# EAGLE design FCCH_RFID_ESTOP (EAGLE 9.6.2)
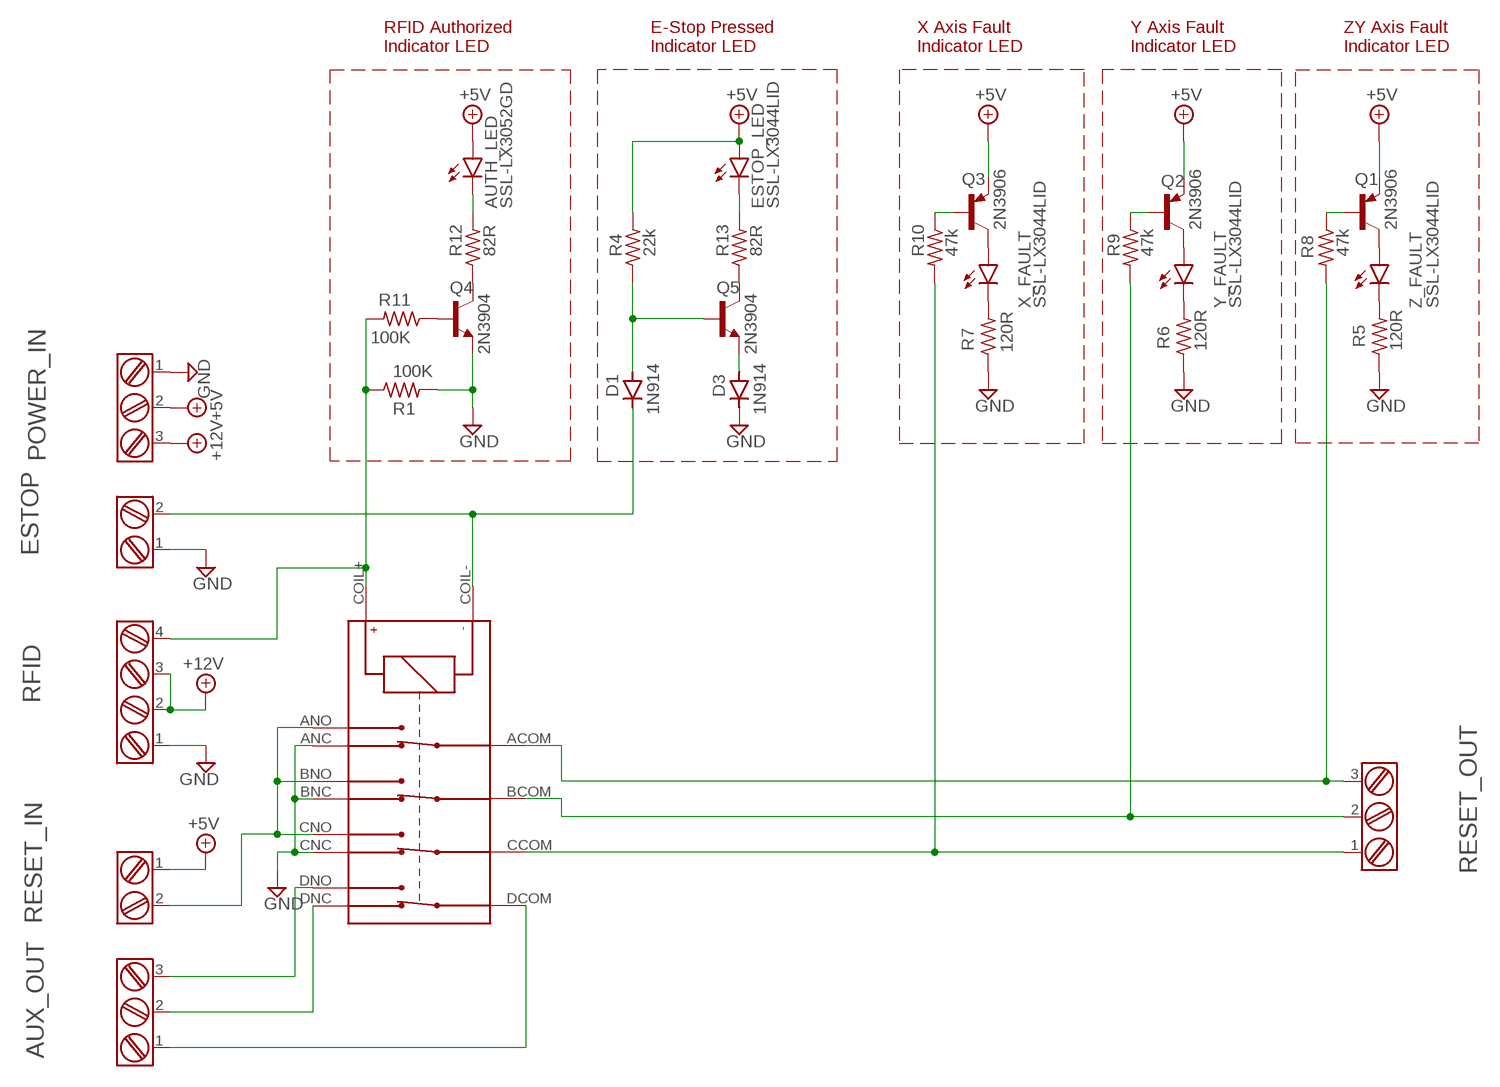
[diagram p0: schematic, sheet 1]

## Parts
AUTH_LED  SSL-LX3052GD  LED3MM  [LED3MM]
AUX_OUT  EURO-CON-3_2.54P  [CONN3-2.54P]
D1  1N914  DIODE-D-5  [D-5]
D3  1N914  DIODE-D-5  [D-5]
ESTOP  EURO-CON-2_2.54P  [CONN2_2.54P]
ESTOP_LED  SSL-LX3044LID  LED3MM  [LED3MM]
POWER_IN  EURO-CON-3_2.54P  [CONN3-2.54P]
Q1  2N3906  [TO92]
Q2  2N3906  [TO92]
Q3  2N3906  [TO92]
Q4  2N3904  [TO92]
Q5  2N3904  [TO92]
R1  100K  R-US_0204/7  [0204/7]
R4  22k  R-US_0204/7  [0204/7]
R5  120R  R-US_0204/7  [0204/7]
R6  120R  R-US_0204/7  [0204/7]
R7  120R  R-US_0204/7  [0204/7]
R8  47k  R-US_0204/7  [0204/7]
R9  47k  R-US_0204/7  [0204/7]
R10  47k  R-US_0204/7  [0204/7]
R11  100K  R-US_0204/7  [0204/7]
R12  82R  R-US_0204/7  [0204/7]
R13  82R  R-US_0204/7  [0204/7]
RESET_IN  EURO-CON-2_2.54P  [CONN2_2.54P]
RESET_OUT  EURO-CON-3_2.54P  [CONN3-2.54P]
RFID  EURO-CON-4_2.54P  [CONN4-2.54P]
U$1  NC4D-JP-DC5V  [NC4D-JP]
X_FAULT  SSL-LX3044LID  LED3MM  [LED3MM]
Y_FAULT  SSL-LX3044LID  LED3MM  [LED3MM]
Z_FAULT  SSL-LX3044LID  LED3MM  [LED3MM]

## Nets
+5V [Power]: AUTH_LED.A ESTOP_LED.A POWER_IN.2 Q1.3(E) Q2.3(E) Q3.3(E) R4.2 RESET_IN.1
+12V [Power]: POWER_IN.3 RFID.2 RFID.3
AUX_RELAY_COM: AUX_OUT.1 U$1.DCOM
AUX_RELAY_NC: AUX_OUT.2 U$1.DNC
AUX_RELAY_NO: AUX_OUT.3 U$1.DNO
ESTOP: D1.C ESTOP.2 U$1.COIL-
GND [Power]: D3.C ESTOP.1 POWER_IN.1 Q4.3(E) R1.2 R5.1 R6.1 R7.1 RFID.1 U$1.ANC U$1.BNC U$1.CNC
N$1: R7.2 X_FAULT.K(C)
N$2: RESET_IN.2 U$1.ANO U$1.BNO U$1.CNO
N$3: Q4.1(C) R12.1
N$4: Q4.2(B) R11.1
N$5: D1.A Q5.2(B) R4.1
N$6: Q5.1(C) R13.1
N$7: D3.A Q5.3(E)
N$8: Q3.1(C) X_FAULT.A
N$9: R6.2 Y_FAULT.K(C)
N$10: Q2.1(C) Y_FAULT.A
N$11: R5.2 Z_FAULT.K(C)
N$12: Q1.1(C) Z_FAULT.A
N$15: ESTOP_LED.K(C) R13.2
N$16: Q3.2(B) R10.1
N$17: AUTH_LED.K(C) R12.2
N$20: Q2.2(B) R9.1
N$24: Q1.2(B) R8.1
RFID_ENABLE: R1.1 R11.2 RFID.4 U$1.COIL+
X_ERR/RES: R10.2 RESET_OUT.1 U$1.CCOM
Y_ERR/RES: R9.2 RESET_OUT.2 U$1.BCOM
Z_ERR/RES: R8.2 RESET_OUT.3 U$1.ACOM

## Notes on the sheet
- RFID Authorized
  Indicator LED
- E-Stop Pressed
  Indicator LED
- X Axis Fault
  Indicator LED
- Y Axis Fault
  Indicator LED
- ZY Axis Fault
  Indicator LED

## Library data of the parts
AUTH_LED ESTOP_LED X_FAULT Y_FAULT Z_FAULT = led:LED: LED OSRAM: - CHIPLED LG R971, LG N971, LY N971, LG Q971, LY Q971, LO R971, LY R971 LH N974, LH R974 LS Q976, LO Q976, LY Q976 LO Q996 - Hyper CHIPLED LW Q18S LB Q993, LB Q99A, LB R99A - SideLED LS A670, LO A670, LY A670, LG A670, LP A670 LB A673, LV A673, LT A673, LW A673 LH A674 LY A675 LS A676, LA A676, LO A676, LY A676, LW A676 LS A679, LY A679, LG A679 - Hyper Micro SIDELED® LS Y876, LA Y876, LO Y876, LY Y876 LT Y87S - SmartLED LW L88C, LW L88S LB L89C, LB L89S, LG L890 LS L89K, LO L89K, LY L89K LS L896, LA L896, LO L896, LY L896 - TOPLED LS T670, LO T670, LY T670, LG T670, LP T670 LSG T670, LSP T670, LSY T670, LOP T670, LYG T670 LG T671, LOG T671, LSG T671 LB T673, LV T673, LT T673, LW T673 LH T674 LS T676, LA T676, LO T676, LY T676, LB T676, LH T676, LSB T676, LW T676 LB T67C, LV T67C, LT T67C, LS T67K, LO T67K, LY T67K, LW E67C LS E67B, LA E67B, LO E67B, LY E67B, LB E67C, LV E67C, LT E67C LW T67C LS T679, LY T679, LG T679 LS T770, LO T770, LY T770, LG T770, LP T770 LB T773, LV T773, LT T773, LW T773 LH T774 LS E675, LA E675, LY E675, LS T675 LS T776, LA T776, LO T776, LY T776, LB T776 LHGB T686 LT T68C, LB T68C - Hyper Mini TOPLED® LB M676 - Mini TOPLED Santana® LG M470 LS M47K, LO M47K, LY M47K Source: http://www.osram.convergy.de LUXEON: - LUMILED® LXK2-PW12-R00, LXK2-PW12-S00, LXK2-PW14-U00, LXK2-PW14-V00 LXK2-PM12-R00, LXK2-PM12-S00, LXK2-PM14-U00 LXK2-PE12-Q00, LXK2-PE12-R00, LXK2-PE12-S00, LXK2-PE14-T00, LXK2-PE14-U00 LXK2-PB12-K00, LXK2-PB12-L00, LXK2-PB12-M00, LXK2-PB14-N00, LXK2-PB14-P00, LXK2-PB14-Q00 LXK2-PR12-L00, LXK2-PR12-M00, LXK2-PR14-Q00, LXK2-PR14-R00 LXK2-PD12-Q00, LXK2-PD12-R00, LXK2-PD12-S00 LXK2-PH12-R00, LXK2-PH12-S00 LXK2-PL12-P00, LXK2-PL12-Q00, LXK2-PL12-R00 Source: www.luxeon.com KINGBRIGHT: KA-3528ASYC Source: www.kingbright.com
AUX_OUT POWER_IN RESET_OUT = fcch_eagle_parts_metal_mill:EURO-CON-3: Terminal block PCB Mound Side Wire Entry Stacking; CENTROID_NOT_SPECIFIED: No; CONTACT_MATERIAL: Brass; CONTACT_PLATING: Tin; DATASHEET: http://www.te.com/commerce/DocumentDelivery/DDEController?Action=srchrtrv&DocNm=282834&DocType=Customer+Drawing&DocLang=English; DIGIKEY_DESCRIPTION: CONN 3 Position Wire to Board Terminal Block Horizontal with Board 0.100" (2.54mm) Through Hole; DIGIKEY_PART_NUMBER: A98334-ND; ELV_COMPLIANT: Compliant; FLAMMABILITY_RATING: UL 94 V-0; HOUSING_COLOR: Green; HOUSING_MATERIAL: Nylon 6/6; IMPORTED_FROM: octopart; IS_FEMALE: yes; LEAD_FREE: yes; MF: TE; MOUNTING_TYPE: through hole; MOUSER_PART_NUMBER: 571-2828343; MPN: 282834-3; NUMBER_OF_CONTACTS: 3; NUMBER_OF_POSITIONS: 3; NUMBER_OF_ROWS: 1; NUM_PINS: 3; OCTOPART_PART_NUMBER: d6ef1fe147770928; PACKAGE: PTH_TBLK_8MM08_6MM5; PIN_PITCH: 2.54 mm; PREFIX: J; ROHS: yes; SIZE_HEIGHT: 10 mm; SIZE_LENGTH: 8.08 mm; SIZE_WIDTH: 6.5 mm; TEMPERATURE_RANGE_HIGH: +105°C; TEMPERATURE_RANGE_LOW: -40°C; VOLTAGE: 150V
D1 D3 = diode:DIODE-: DIODE
ESTOP RESET_IN = fcch_eagle_parts_metal_mill:EURO-CON-2: TERMI-BLOK PCB MOUNT, 90 2P; CENTROID_NOT_SPECIFIED: No; DATASHEET: https://upverter.com/datasheet/7f220f754b96d6f927a9f190bfd569f7426e06b7.pdf; DIGIKEY_DESCRIPTION: CONN TERM BLOCK 2POS SIDE ENT 2.54MM; DIGIKEY_PART_NUMBER: A98333-ND; LEAD_FREE: yes; MF: TE; MOUSER_PART_NUMBER: 571-282834-2; MPN: 282834-2; PACKAGE: PTH_TBLK_5MM54_6MM5; PREFIX: J; ROHS: yes; TEMPERATURE_RANGE_HIGH: +105°C; TEMPERATURE_RANGE_LOW: -40°C
Q1-Q3 = transistor-pnp:2N3906: PNP Transistor
Q4 Q5 = transistor-npn:2N3904: NPN Transistor
R1 R4-R13 = rcl:R-US_: RESISTOR, American symbol; SPICEPREFIX: R
RFID = fcch_eagle_parts_metal_mill:EURO-CON-4: 4 Position Wire to Board Terminal Block Horizontal with Board 0.100" (2.54mm) Through Hole; AUTOMOTIVE: No; CENTROID_NOT_SPECIFIED: No; CONN_GENDER: Female; CONN_ORIENTATION: Horizontal; CONTACT_MATERIAL: Tin; CURRENT_RATING: 10A; DATASHEET: https://www.te.com/commerce/DocumentDelivery/DDEController?Action=showdoc&DocId=Customer+Drawing%7F282834%7FC1%7Fpdf%7FEnglish%7FENG_CD_282834_C1.pdf%7F282834-4; DEVICE_CLASS_L1: Connectors; DEVICE_CLASS_L2: Terminal Blocks | Terminals; DEVICE_CLASS_L3: unset; DIGIKEY_DESCRIPTION: TERM BLK 4P SIDE ENT 2.54MM PCB; DIGIKEY_PART_NUMBER: A98335-ND; FOOTPRINT_VARIANT_NAME_0: Recommended_Land_Pattern; HEIGHT: 10.3mm; IMPORTED_FROM: octopart; IS_FEMALE: yes; LEAD_FREE: Yes; MAX_WIRE_GAUGE: 16; MF: TE; MFG_PACKAGE_IDENT: 0; MFG_PACKAGE_IDENT_DATE: 0; MFG_PACKAGE_IDENT_REV: 0; MIN_WIRE_GAUGE: 30; MOUNTING_TYPE: through hole; MOUSER_DESCRIPTION: Wire to Board 4 Position 2.54 mm Pitch 30-16 AWG Euro Style Terminal Block; MOUSER_PART_NUMBER: 571-282834-4; MPN: 282834-4; NUMBER_OF_CONTACTS: 4; NUMBER_OF_ROWS: 1; NUM_PINS: 4; PACKAGE: HDR4; PITCH: 2.54mm; PREFIX: J; ROHS: Yes; TEMPERATURE_RANGE_HIGH: +110°C; TEMPERATURE_RANGE_LOW: -40°C; VERIFICATION_VERSION: 0.0.0.3; VOLTAGE_RATING: 150V
U$1 = fcch_eagle_parts_metal_mill:NC4D-JP-DC5V

## Net classes
1 Power: width 0.508 mm

## Board
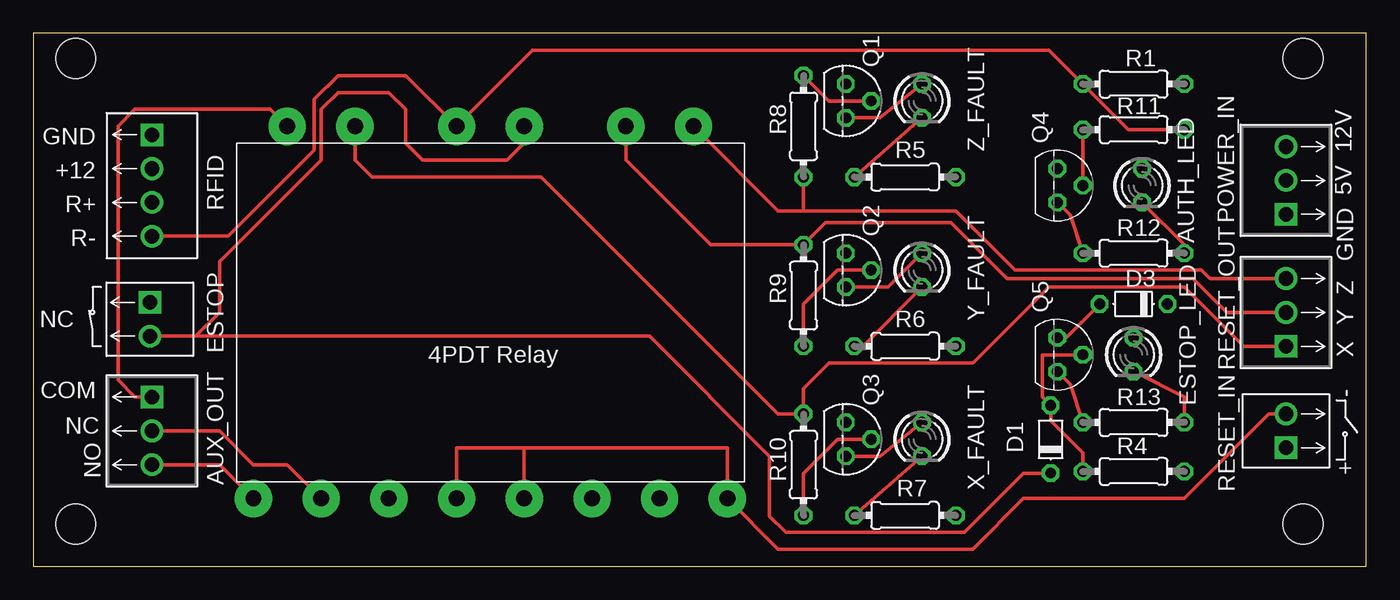
[diagram p1: board, top side]
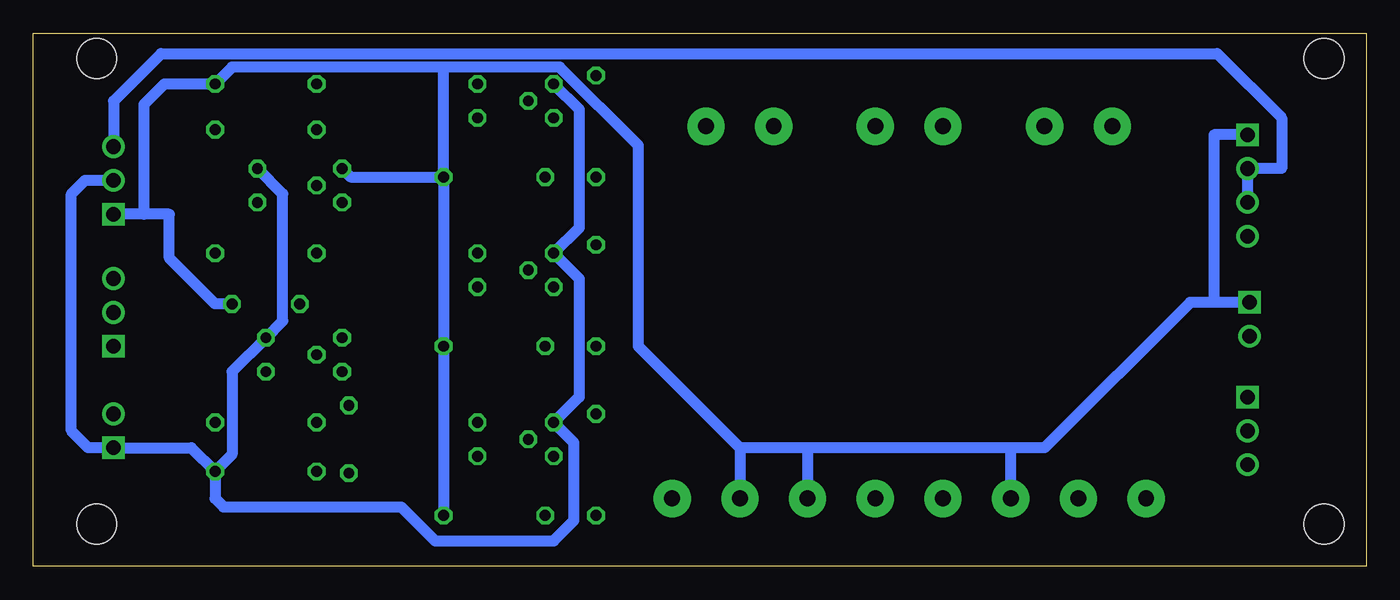
[diagram p2: board, bottom side, seen from below]

Size 100 x 40 mm. Coordinates in mm from the lower left corner, seen from the top.
Outline: 0,0 100,0 100,40 0,40 0,0
Copper layers (1*16): Top 0.035mm / dielectric 1.5mm / Bottom 0.035mm
Design rules "default": minimum track width 6mil, minimum drill 0.35mm, track to track 6mil, track to pad 6mil, pad to pad 6mil, via to via 6mil, smd to smd 6mil, copper to edge 40mil, drill to drill 6mil, minimum pad ring 10mil, minimum via ring 8mil, stop-mask expansion 4mil, vias tented up to drill 0mil, thermal gap 10mil
Holes 3 mm at 3.17,3.17 3.17,38.1 95.25,38.1 95.25,3.17

### Footprints (pad centres in the part's own frame; a part is rotated, then mirrored left to right if it is on the bottom)
LED3MM = drill 0.813 octagon: A -1.27,0; K 1.27,0
CONN3-2.54P = drill 1.1 pad 1.7 square: 1 0,2.54 | drill 1.1 pad 1.7: 2 0,0; 3 0,-2.54
D-5 = drill 0.813 octagon: A 2.54,0; C -2.54,0
CONN2_2.54P = drill 1.1 pad 1.7 square: 1 -1.27,0 | drill 1.1 pad 1.7: 2 1.27,0
TO92 = drill 0.813 octagon: 1 1.27,0; 2 0,1.905; 3 -1.27,0
0204/7 = drill 0.813 octagon: 1 -3.81,0; 2 3.81,0
CONN4-2.54P = drill 1.1 pad 1.7 square: 1 -3.81,0 | drill 1.1 pad 1.7: 2 -1.27,0; 3 1.27,0; 4 3.81,0
NC4D-JP = drill 1.194 pad 2.794: ACOM -15.24,-13.97; ANC -12.7,13.97; ANO -17.78,13.97; BCOM -10.16,-13.97; BNC -7.62,13.97; BNO -2.54,13.97; CCOM 10.16,-13.97; CNC 7.62,13.97; CNO 2.54,13.97; COIL+ 2.54,-13.97; COIL- -2.54,-13.97; DCOM 15.24,-13.97; DNC 12.7,13.97; DNO 17.78,13.97

### Placement (x,y rotation side)
AUTH_LED  83.19,28.57 270 top
AUX_OUT  8.89,10.16 0 top
D1  76.33,9.53 90 top
D3  82.55,19.68 180 top
ESTOP  8.74,18.54 270 top
ESTOP_LED  82.55,15.88 270 top
POWER_IN  93.98,28.96 180 top
Q1  60.96,34.92 270 top
Q2  60.96,22.23 270 top
Q3  60.96,9.53 270 top
Q4  76.83,28.57 270 top
Q5  76.83,15.88 270 top
R1  82.55,36.2 0 top
R4  82.55,7.11 0 top
R5  65.41,29.21 180 top
R6  65.41,16.51 180 top
R7  65.41,3.81 180 top
R8  57.78,33.02 270 top
R9  57.78,20.32 90 top
R10  57.78,7.62 90 top
R11  82.55,32.77 0 top
R12  82.55,23.5 0 top
R13  82.55,10.79 0 top
RESET_IN  93.98,10.16 90 top
RESET_OUT  93.98,19.05 180 top
RFID  8.89,28.57 270 top
U$1  34.29,19.05 180 top
X_FAULT  66.67,9.53 270 top
Y_FAULT  66.67,22.23 270 top
Z_FAULT  66.67,34.92 270 top

### Tracks (layer width: path | path; a pad name or v marks a point on that pad's centre or on a via)
+5V
  Bottom 0.813: POWER_IN.2 96.14,28.96 97.16,27.94 97.16,10.16 95.89,8.89 RESET_IN.1 88.14,8.89 R4.2 | Q1.3 59.05,34.29 59.05,25.4 Q2.3 59.05,21.59 59.05,12.7 Q3.3 59.44,9.27 59.44,3.43 60.96,1.91 69.85,1.91 72.39,4.45 85.72,4.45 86.36,5.08 R4.2 | R4.2 85.09,8.38 85.09,14.61 ESTOP_LED.A 81.28,18.41 81.28,27.94 AUTH_LED.A
+12V
  Bottom 0.813: RFID.3 RFID.2 6.35,29.84 6.35,33.66 11.18,38.48 90.42,38.48 93.98,34.92 POWER_IN.3
AUX_RELAY_COM
  Top 0.254: U$1.DCOM 17.78,34.29 7.62,34.29 6.35,33.02 6.35,13.97 7.62,12.7 AUX_OUT.1
AUX_RELAY_NC
  Top 0.254: U$1.DNC 19.05,7.62 16.51,7.62 13.97,10.16 AUX_OUT.2
AUX_RELAY_NO
  Top 0.254: AUX_OUT.3 13.97,7.62 U$1.DNO
ESTOP
  Top 0.254: U$1.COIL- 36.83,31.75 35.56,30.48 29.21,30.48 27.94,31.75 27.94,34.29 26.67,35.56 22.86,35.56 21.59,34.29 21.59,30.48 13.97,22.86 13.97,19.05 12.19,17.27 ESTOP.2 46.23,17.27 55.24,8.26 55.24,3.75 56.46,2.54 69.85,2.54 74.3,6.99 D1.C
GND
  Bottom 0.813: ESTOP.1 11.43,19.81 | 11.43,19.81 13.21,19.81 24.13,8.89 26.67,8.89 | U$1.CNC 26.67,8.89 | 26.67,8.89 41.91,8.89 | 41.91,8.89 U$1.BNC | 41.91,8.89 46.99,8.89 | 46.99,8.89 U$1.ANC | 11.43,19.81 11.43,32.38 RFID.1 | 69.22,37.47 60.51,37.47 54.61,31.57 54.61,16.51 46.99,8.89 | 69.22,37.47 85.09,37.47 R1.2 90.17,36.2 91.69,34.67 91.69,26.42 | 91.69,26.42 89.79,26.42 89.79,23.11 86.36,19.68 D3.C | 91.69,26.42 POWER_IN.1 | R5.1 69.22,37.47 | R5.1 R6.1 R7.1 | Q4.3 76.2,29.21 R5.1
N$1
  Top 0.254: X_FAULT.K R7.2
N$2
  Top 0.254: 36.83,8.89 52.07,8.89 U$1.ANO 55.88,1.27 70.48,1.27 74.3,5.08 86.36,5.08 92.71,11.43 RESET_IN.2 | 36.83,8.89 U$1.BNO | U$1.CNO 31.75,8.89 36.83,8.89
N$3
  Top 0.254: Q4.1 77.79,26.35 R12.1
N$4
  Top 0.254: Q4.2 R11.1
N$5
  Top 0.254: Q5.2 75.69,15.88 75.69,12.7 D1.A 76.33,10.92 78.74,8.51 R4.1
N$6
  Top 0.254: Q5.1 77.79,13.65 R13.1
N$7
  Top 0.254: D3.A 77.47,17.14 Q5.3
N$8
  Top 0.254: Q3.1 63.5,8.26 X_FAULT.A
N$9
  Top 0.254: Y_FAULT.K 62.23,16.51 R6.2
N$10
  Top 0.254: Q2.1 64.14,20.95 Y_FAULT.A
N$11
  Top 0.254: R5.2 Z_FAULT.K
N$12
  Top 0.254: Q1.1 63.5,33.66 Z_FAULT.A
N$15
  Top 0.254: ESTOP_LED.K 86.36,12.7 R13.2
N$16
  Top 0.254: Q3.2 60.33,9.53 57.78,6.99 R10.1
N$17
  Top 0.254: AUTH_LED.K 86.36,24.13 R12.2
N$20
  Top 0.254: Q2.2 60.33,22.23 57.78,19.68 R9.1
N$24
  Top 0.254: Q1.2 59.69,34.92 R8.1
RFID_ENABLE
  Top 0.254: RFID.4 14.61,24.77 21.08,31.24 21.08,35.05 22.86,36.83 27.94,36.83 U$1.COIL+ 37.47,38.73 76.2,38.73 R1.1 82.17,32.77 R11.2
X_ERR/RES
  Top 0.254: U$1.CCOM 24.13,30.48 25.4,29.21 38.1,29.21 55.88,11.43 R10.2 57.78,13.34 59.69,15.24 70.48,15.24 76.2,20.95 86.36,20.95 90.81,16.51 RESET_OUT.1
Y_ERR/RES
  Top 0.254: U$1.BCOM 44.45,30.48 50.8,24.13 R9.2 59.44,25.78 68.83,25.78 73.03,21.59 87,21.59 89.53,19.05 RESET_OUT.2
Z_ERR/RES
  Top 0.254: U$1.ACOM 55.88,26.67 57.78,26.67 | 57.78,26.67 69.22,26.67 73.66,22.23 87.63,22.23 88.27,21.59 RESET_OUT.3 | R8.2 57.78,26.67

### Text on the board
tNames: 12V | GND | +12 | 5V | R+ | GND | R- | Z | NC | Y | X | COM | - | NC | NO | +